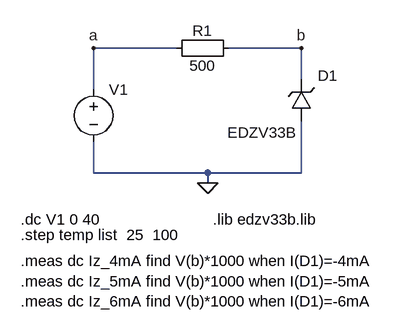
[diagram p0: schematic VA-R-DEMO.asc]
VA-R-DEMO.asc, the LTspice schematic file:
Version 4
SHEET 1 880 680
WIRE 16 -336 -112 -336
WIRE 208 -336 96 -336
WIRE 208 -288 208 -336
WIRE -112 -272 -112 -336
WIRE -112 -144 -112 -192
WIRE 64 -144 -112 -144
WIRE 208 -144 208 -224
WIRE 208 -144 64 -144
WIRE 64 -128 64 -144
FLAG 64 -128 0
FLAG 208 -336 b
FLAG -112 -336 a
SYMBOL Misc\\EuropeanResistor 112 -352 R90
WINDOW 0 5 56 VBottom 2
WINDOW 3 27 56 VTop 2
SYMATTR InstName R1
SYMATTR Value 500
SYMBOL voltage -112 -288 R0
WINDOW 3 24 96 Invisible 2
SYMATTR Value ""
SYMATTR InstName V1
SYMBOL zener 224 -224 R180
WINDOW 0 -40 70 Left 2
WINDOW 3 23 -18 Left 2
SYMATTR InstName D1
SYMATTR Value EDZV33B
TEXT -224 -72 Left 2 !.dc V1 0 40
TEXT -224 -48 Left 2 !.step temp list  25  100
TEXT 72 -72 Left 2 !.lib edzv33b.lib
TEXT -224 -8 Left 2 !.meas dc Iz_4mA find V(b)*1000 when I(D1)=-4mA\n.meas dc Iz_5mA find V(b)*1000 when I(D1)=-5mA\n.meas dc Iz_6mA find V(b)*1000 when I(D1)=-6mA

The netlist it stands for:
* VA-R-DEMO.asc
R1 b a 500
V1 a 0
D1 0 b EDZV33B
.model D D
.lib standard.dio
.dc V1 0 40
.step temp list  25  100
.lib edzv33b.lib
.meas dc Iz_4mA find V(b)*1000 when I(D1)=-4mA
.meas dc Iz_5mA find V(b)*1000 when I(D1)=-5mA
.meas dc Iz_6mA find V(b)*1000 when I(D1)=-6mA
.backanno
.end